# EAGLE schematic Simple_SPI (EAGLE 8.4.3)
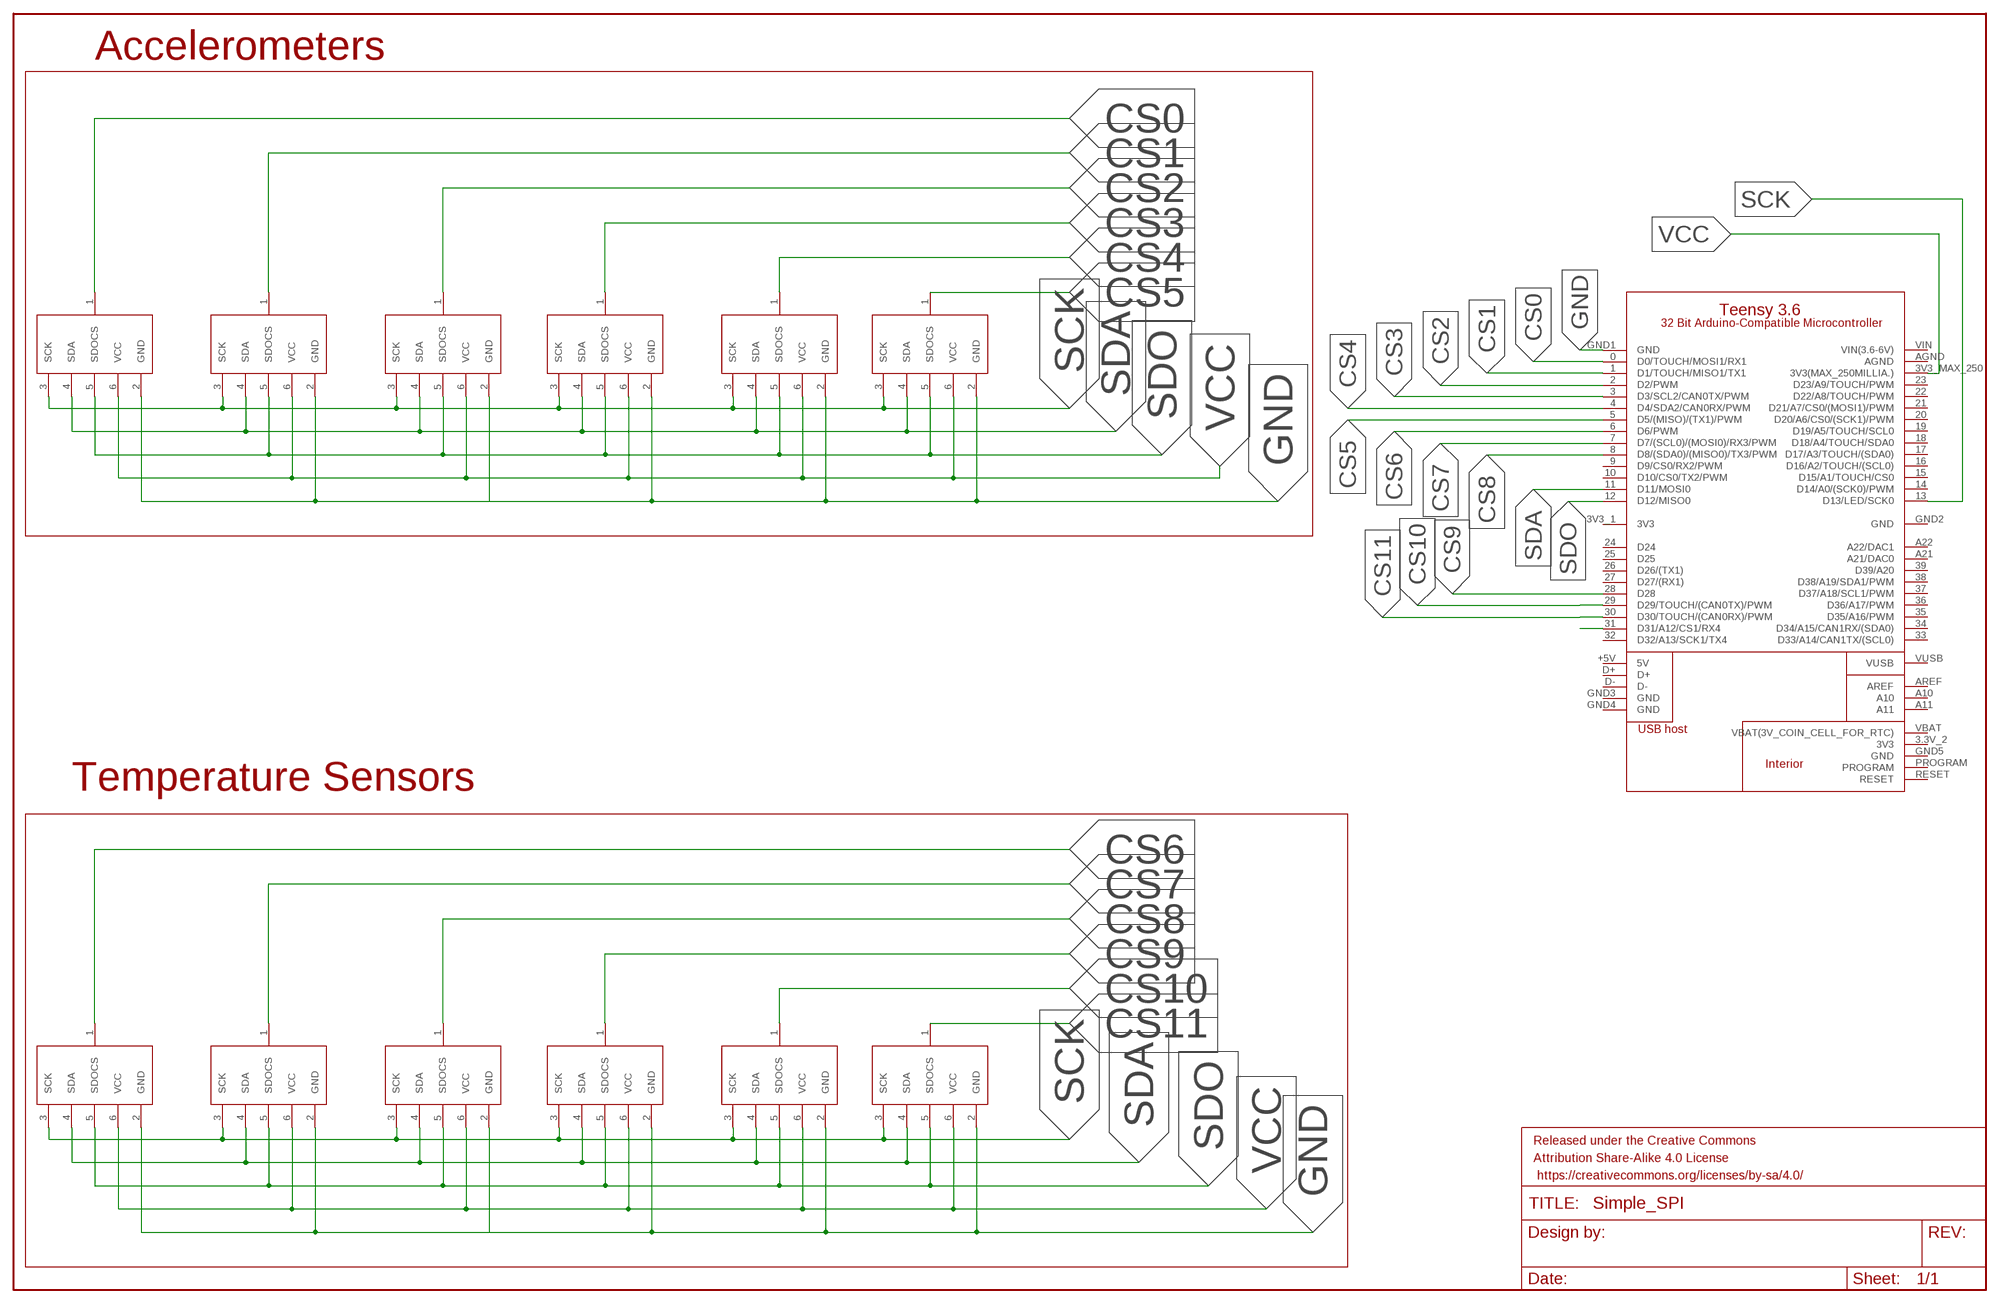
[diagram p0: schematic, sheet 1]

## Parts
FRAME1  FRAME-LEDGER  [CREATIVE_COMMONS]
U$1  GENERIC_SPI  [8PINSMD]
U$2  GENERIC_SPI  [8PINSMD]
U$3  GENERIC_SPI  [8PINSMD]
U$4  GENERIC_SPI  [8PINSMD]
U$5  GENERIC_SPI  [8PINSMD]
U$6  GENERIC_SPI  [8PINSMD]
U$7  GENERIC_SPI  [8PINSMD]
U$8  GENERIC_SPI  [8PINSMD]
U$9  GENERIC_SPI  [8PINSMD]
U$10  GENERIC_SPI  [8PINSMD]
U$11  GENERIC_SPI  [8PINSMD]
U$12  GENERIC_SPI  [8PINSMD]
U$13  TEENSY-3.6_ONLY_HOLES  [TEENSY-3.6_ONLY_HOLES]

## Nets
CS0: U$7.1(CS) U$13.0(D0/TOUCH/MOSI1/RX1)
CS1: U$8.1(CS) U$13.1(D1/TOUCH/MISO1/TX1)
CS2: U$9.1(CS) U$13.2(D2/PWM)
CS3: U$10.1(CS) U$13.3(D3/SCL2/CAN0TX/PWM)
CS4: U$11.1(CS) U$13.4(D4/SDA2/CAN0RX/PWM)
CS5: U$12.1(CS) U$13.5(D5/(MISO)/(TX1)/PWM)
CS6: U$1.1(CS) U$13.6(D6/PWM)
CS7: U$2.1(CS) U$13.7(D7/(SCL0)/(MOSI0)/RX3/PWM)
CS8: U$3.1(CS) U$13.8(D8/(SDA0)/(MISO0)/TX3/PWM)
CS9: U$4.1(CS) U$13.28(D28)
CS10: U$5.1(CS) U$13.29(D29/TOUCH/(CAN0TX)/PWM)
CS11: U$6.1(CS) U$13.30(D30/TOUCH/(CAN0RX)/PWM)
GND: U$1.2(GND) U$2.2(GND) U$3.2(GND) U$4.2(GND) U$5.2(GND) U$6.2(GND) U$7.2(GND) U$8.2(GND) U$9.2(GND) U$10.2(GND) U$11.2(GND) U$12.2(GND) U$13.GND1(GND)
N$4: U$13.31(D31/A12/CS1/RX4)
SCK: U$1.3(SCK) U$2.3(SCK) U$3.3(SCK) U$4.3(SCK) U$5.3(SCK) U$6.3(SCK) U$7.3(SCK) U$8.3(SCK) U$9.3(SCK) U$10.3(SCK) U$11.3(SCK) U$12.3(SCK) U$13.13(D13/LED/SCK0)
SDA: U$1.4(SDA) U$2.4(SDA) U$3.4(SDA) U$4.4(SDA) U$5.4(SDA) U$6.4(SDA) U$7.4(SDA) U$8.4(SDA) U$9.4(SDA) U$10.4(SDA) U$11.4(SDA) U$12.4(SDA) U$13.11(D11/MOSI0)
SDO: U$1.5(SDO) U$2.5(SDO) U$3.5(SDO) U$4.5(SDO) U$5.5(SDO) U$6.5(SDO) U$7.5(SDO) U$8.5(SDO) U$9.5(SDO) U$10.5(SDO) U$11.5(SDO) U$12.5(SDO) U$13.12(D12/MISO0)
VCC: U$1.6(VCC) U$2.6(VCC) U$3.6(VCC) U$4.6(VCC) U$5.6(VCC) U$6.6(VCC) U$7.6(VCC) U$8.6(VCC) U$9.6(VCC) U$10.6(VCC) U$11.6(VCC) U$12.6(VCC) U$13.3V3_MAX_250(3V3(MAX_250MILLIA.))
Unconnected: U$13.3.3V_2(3V3) U$13.9(D9/CS0/RX2/PWM) U$13.10(D10/CS0/TX2/PWM) U$13.14(D14/A0/(SCK0)/PWM) U$13.15(D15/A1/TOUCH/CS0) U$13.16(D16/A2/TOUCH/(SCL0)) U$13.17(D17/A3/TOUCH/(SDA0)) U$13.18(D18/A4/TOUCH/SDA0) U$13.19(D19/A5/TOUCH/SCL0) U$13.20(D20/A6/CS0/(SCK1)/PWM) U$13.21(D21/A7/CS0/(MOSI1)/PWM) U$13.22(D22/A8/TOUCH/PWM) U$13.23(D23/A9/TOUCH/PWM) U$13.24(D24) U$13.25(D25) U$13.26(D26/(TX1)) U$13.27(D27/(RX1)) U$13.32(D32/A13/SCK1/TX4) U$13.33(D33/A14/CAN1TX/(SCL0)) U$13.34(D34/A15/CAN1RX/(SDA0)) U$13.35(D35/A16/PWM) U$13.36(D36/A17/PWM) U$13.37(D37/A18/SCL1/PWM) U$13.38(D38/A19/SDA1/PWM) U$13.39(D39/A20) U$13.+5V(5V) U$13.A10 U$13.A11 U$13.A21(A21/DAC0) U$13.A22(A22/DAC1) U$13.AREF U$13.D+ U$13.D- U$13.GND3(GND) U$13.GND4(GND) U$13.GND5(GND) U$13.PROGRAM U$13.RESET U$13.VBAT(VBAT(3V_COIN_CELL_FOR_RTC)) U$13.VUSB

## Notes on the sheet
- Accelerometers
- Temperature Sensors

## Power pins joined to a net without a drawn wire
3V3: U$13.3V3_1(3V3)
AGND: U$13.AGND
GND: U$13.GND2(GND)
VIN(3.6-6V): U$13.VIN(VIN(3.6-6V))

## Library data of the parts
FRAME1 = SparkFun-Aesthetics:FRAME-LEDGER: Schematic Frame - Ledger Standard 11x14 US Ledger frame
U$1-U$12 = WavefrontLBR:GENERIC_SPI
U$13 = Teensy-3.6:TEENSY-3.6_ONLY_HOLES